# Altium project Jig.PrjPcb
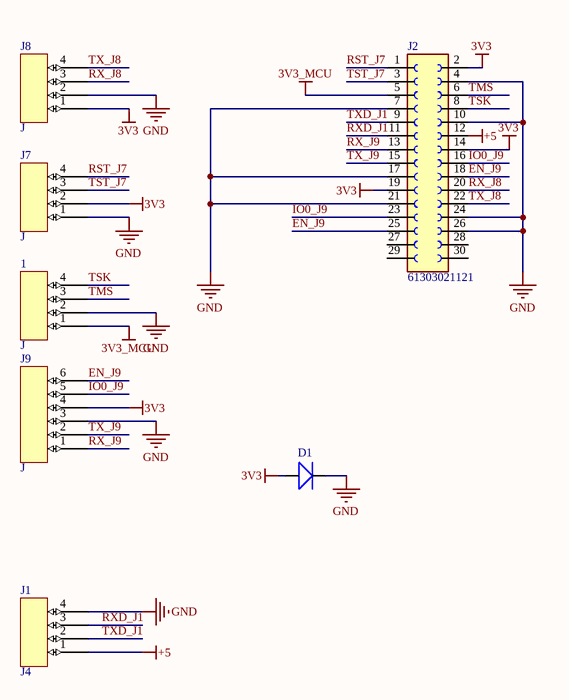
[diagram p0: Sheet1.SchDoc]
2 sheets, 14 parts. Net scope: global (net labels, ports and power ports of the same name join across sheets).
Board files: Square.PcbDoc, Rectangle.PcbDoc
Sheets:
  Sheet1.SchDoc
  Sheet2.SchDoc

## Sheet Sheet1.SchDoc
size A; SheetNumber: 1; SheetTotal: 2

### Parts
1  J  [J4]
D1  SMD-DIODE-SWITCHING-75V-150MA(D1206)  [LED-1206]  (value not drawn)
J1  J4  [J4]
J2  61303021121  [61303021121]
J7  J  [J4]
J8  J  [J4]
J9  J  [J6]

### Nets
3V3: D1.POS J2.2 J2.14 J2.19 J7.2 J8.1 J9.4
3V3_MCU: 1.1 J2.5
+5: J1.1 J2.12
GND: 1.2 D1.NEG J1.4 J2.4 J2.7 J2.10 J2.17 J2.21 J2.24 J2.26 J7.1 J8.2 J9.3
EN_J9: J2.18 J2.25 J9.6
IO0_J9: J2.16 J2.23 J9.5
RST_J7: J2.1 J7.4
RX_J8: J2.20 J8.3
RX_J9: J2.13 J9.1
RXD_J1: J1.3 J2.11
TMS: 1.3 J2.6
TSK: 1.4 J2.8
TST_J7: J2.3 J7.3
TX_J8: J2.22 J8.4
TX_J9: J2.15 J9.2
TXD_J1: J1.2 J2.9

Not connected (* = marked no-connect by the designer): J2 27(14) 28(17) 29(15) 30(16)

### Library data of the parts
1 J7 J8 = J4
D1 = SMD-DIODE-SWITCHING-75V-150MA(D1206): 304040005; MF: {'manufacturer': u'Bourns'}; Package: None; Availability: Unavailable; Price: None; MP: SMD-DIODE-SWITCHING-75V-150MA(D1206); Value: *
J2 = 61303021121: <b> WR-PHD 2.54mm Dual Pin Header, 30 Pins </b>=>Code : Con_BTB_PHD_2.54_2_61303021121 <br><a href="http://katalog.we-online.de/media/images/eican/Con_BTB_PHD_2.54_2_6130xx21121_pf2.jpg" title="Enlarge picture"> <img src="http://katalog.we-online.de/media/thumbs2/eican/thb_Con_BTB_PHD_2.54_2_6130xx21121_pf2.jpg" width="320"></a><p> Details see: <a href="http://katalog.we-online.de/en/em/613_0xx_211_21">http://katalog.we-online.de/en/em/613_0xx_211_21</a><p> Created 2014-05-29, Karrer Zheng<br> 2014 (C) WÃ¼rth Elektronik; MF: {'manufacturer': u'Wurth Elektronik'}; Package: None; Availability: Unavailable; Price: None; MP: 61303021121; Value: *
J9 = J6

## Sheet Sheet2.SchDoc
size A; SheetNumber: 2; SheetTotal: 2
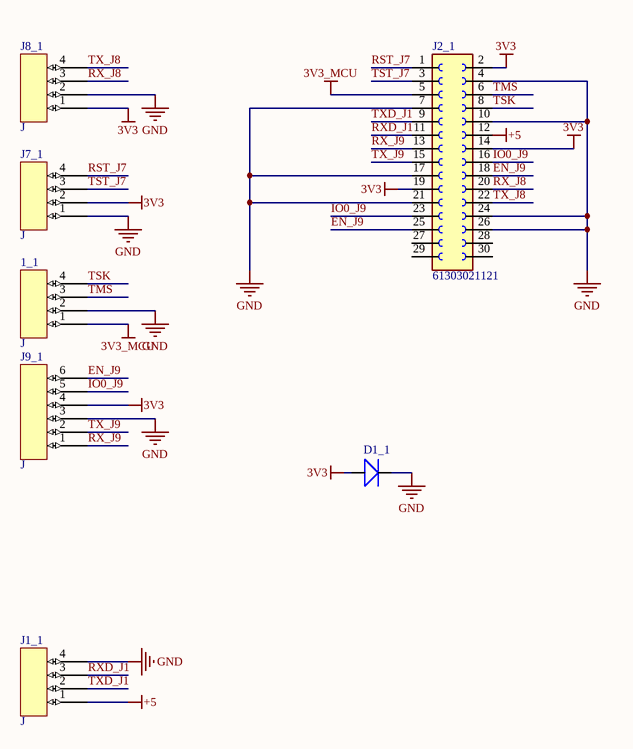
[diagram p1: Sheet2.SchDoc]

### Parts
1_1  J  [J4]
D1_1  SMD-DIODE-SWITCHING-75V-150MA(D1206)  [LED-1206]  (value not drawn)
J1_1  J  [J4]
J2_1  61303021121  [61303021121]
J7_1  J  [J4]
J8_1  J  [J4]
J9_1  J  [J6]

### Nets
3V3: D1_1.POS J2_1.2 J2_1.14 J2_1.19 J7_1.2 J8_1.1 J9_1.4
3V3_MCU: 1_1.1 J2_1.5
+5: J1_1.1 J2_1.12
GND: 1_1.2 D1_1.NEG J1_1.4 J2_1.4 J2_1.7 J2_1.10 J2_1.17 J2_1.21 J2_1.24 J2_1.26 J7_1.1 J8_1.2 J9_1.3
EN_J9: J2_1.18 J2_1.25 J9_1.6
IO0_J9: J2_1.16 J2_1.23 J9_1.5
RST_J7: J2_1.1 J7_1.4
RX_J8: J2_1.20 J8_1.3
RX_J9: J2_1.13 J9_1.1
RXD_J1: J1_1.3 J2_1.11
TMS: 1_1.3 J2_1.6
TSK: 1_1.4 J2_1.8
TST_J7: J2_1.3 J7_1.3
TX_J8: J2_1.22 J8_1.4
TX_J9: J2_1.15 J9_1.2
TXD_J1: J1_1.2 J2_1.9

Not connected (* = marked no-connect by the designer): J2_1 27(14) 28(17) 29(15) 30(16)

### Library data of the parts
1_1 J1_1 J7_1 J8_1 = J4
D1_1 = SMD-DIODE-SWITCHING-75V-150MA(D1206): as D1 on sheet Sheet1; Package: None; Availability: Unavailable; Price: None; MP: SMD-DIODE-SWITCHING-75V-150MA(D1206); Value: *
J2_1 = 61303021121: as J2 on sheet Sheet1; Package: None; Availability: Unavailable; Price: None; MP: 61303021121; Value: *
J9_1 = J6

## Nets that join several sheets
3V3: Sheet1 (7 pins), Sheet2 (7 pins)
3V3_MCU: Sheet1 (1.1 J2.5), Sheet2 (1_1.1 J2_1.5)
+5: Sheet1 (J1.1 J2.12), Sheet2 (J1_1.1 J2_1.12)
GND: Sheet1 (13 pins), Sheet2 (13 pins)
EN_J9: Sheet1 (J2.18 J2.25 J9.6), Sheet2 (J2_1.18 J2_1.25 J9_1.6)
IO0_J9: Sheet1 (J2.16 J2.23 J9.5), Sheet2 (J2_1.16 J2_1.23 J9_1.5)
RST_J7: Sheet1 (J2.1 J7.4), Sheet2 (J2_1.1 J7_1.4)
RX_J8: Sheet1 (J2.20 J8.3), Sheet2 (J2_1.20 J8_1.3)
RX_J9: Sheet1 (J2.13 J9.1), Sheet2 (J2_1.13 J9_1.1)
RXD_J1: Sheet1 (J1.3 J2.11), Sheet2 (J1_1.3 J2_1.11)
TMS: Sheet1 (1.3 J2.6), Sheet2 (1_1.3 J2_1.6)
TSK: Sheet1 (1.4 J2.8), Sheet2 (1_1.4 J2_1.8)
TST_J7: Sheet1 (J2.3 J7.3), Sheet2 (J2_1.3 J7_1.3)
TX_J8: Sheet1 (J2.22 J8.4), Sheet2 (J2_1.22 J8_1.4)
TX_J9: Sheet1 (J2.15 J9.2), Sheet2 (J2_1.15 J9_1.2)
TXD_J1: Sheet1 (J1.2 J2.9), Sheet2 (J1_1.2 J2_1.9)